# Altium schematic sheet FPGA RAM.SchDoc
size A
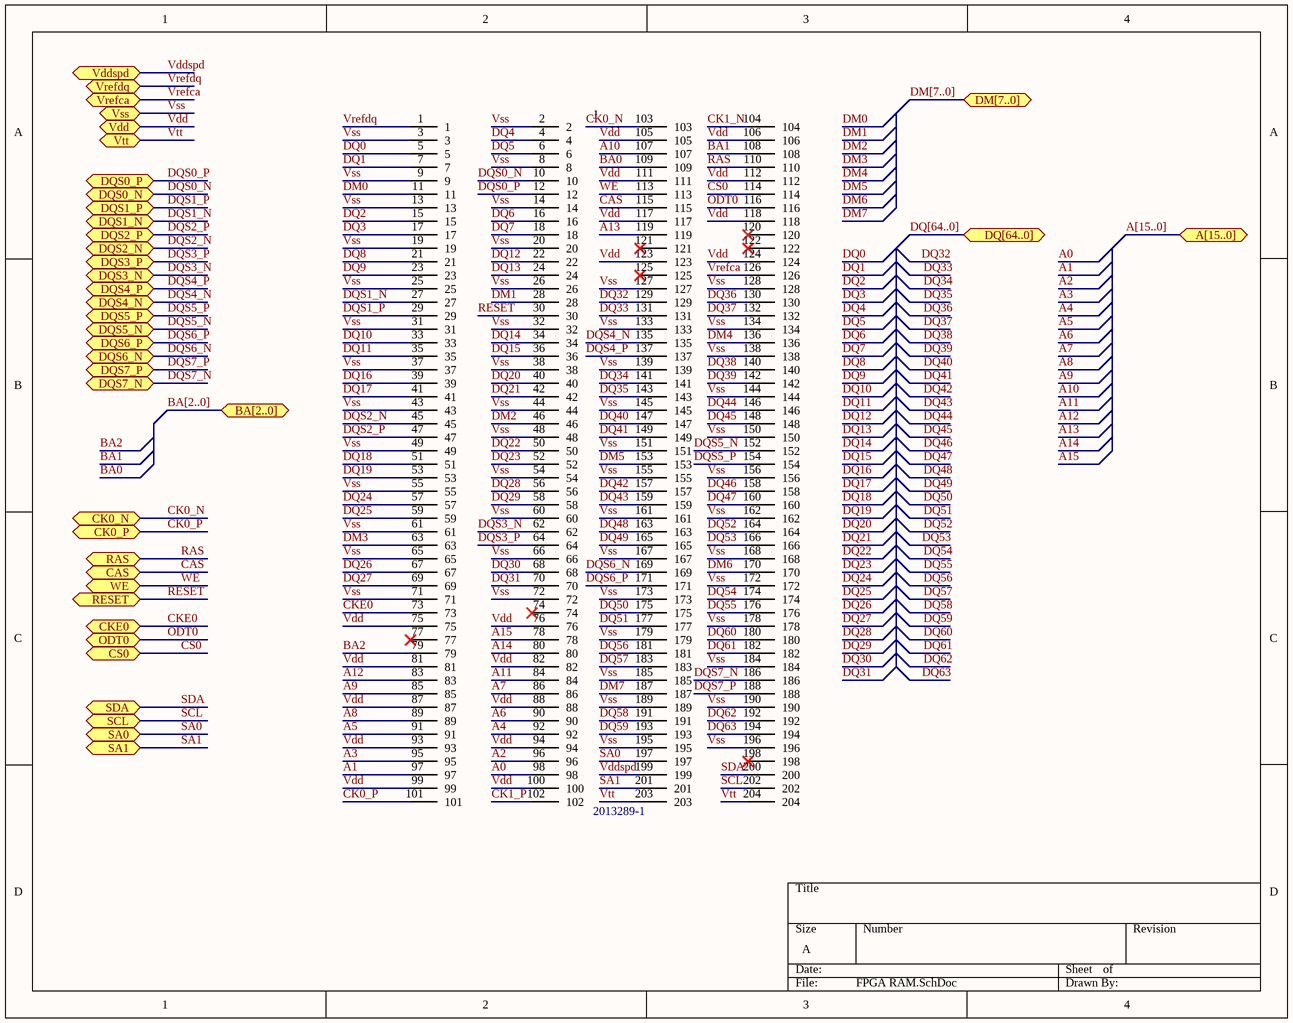
[diagram p0: FPGA RAM.SchDoc]

## Parts
J  2013289-1  [TE_2013289-1]

## Ports
A[15..0] (bidir), BA[2..0] (bidir), CAS (bidir), CK0_N (bidir), CK0_P (bidir), CKE0 (bidir), CS0 (bidir), DM[7..0] (bidir), DQ[64..0] (bidir), DQS0_N (bidir), DQS0_P (bidir), DQS1_N (bidir), DQS1_P (bidir), DQS2_N (bidir), DQS2_P (bidir), DQS3_N (bidir), DQS3_P (bidir), DQS4_N (bidir), DQS4_P (bidir), DQS5_N (bidir), DQS5_P (bidir), DQS6_N (bidir), DQS6_P (bidir), DQS7_N (bidir), DQS7_P (bidir), ODT0 (bidir), RAS (bidir), RESET (bidir), SA0 (bidir), SA1 (bidir), SCL (bidir), SDA (bidir), Vdd (bidir), Vddspd (bidir), Vrefca (bidir), Vrefdq (bidir), Vss (bidir), Vtt (bidir), WE (bidir)

## Nets
A0: J.98
A1: J.97
A2: J.96
A3: J.95
A4: J.92
A5: J.91
A6: J.90
A7: J.86
A8: J.89
A9: J.85
A10: J.107
A11: J.84
A12: J.83
A13: J.119
A14: J.80
A15: J.78
BA0: J.109
BA1: J.108
BA2: J.79
CAS: J.115 ; port CAS
CK0_N: J.103 ; port CK0_N
CK0_P: J.101 ; port CK0_P
CK1_N: J.104
CK1_P: J.102
CKE0: J.73 ; port CKE0
CS0: J.114 ; port CS0
DM0: J.11
DM1: J.28
DM2: J.46
DM3: J.63
DM4: J.136
DM5: J.153
DM6: J.170
DM7: J.187
DQ0: J.5
DQ1: J.7
DQ2: J.15
DQ3: J.17
DQ4: J.4
DQ5: J.6
DQ6: J.16
DQ7: J.18
DQ8: J.21
DQ9: J.23
DQ10: J.33
DQ11: J.35
DQ12: J.22
DQ13: J.24
DQ14: J.34
DQ15: J.36
DQ16: J.39
DQ17: J.41
DQ18: J.51
DQ19: J.53
DQ20: J.40
DQ21: J.42
DQ22: J.50
DQ23: J.52
DQ24: J.57
DQ25: J.59
DQ26: J.67
DQ27: J.69
DQ28: J.56
DQ29: J.58
DQ30: J.68
DQ31: J.70
DQ32: J.129
DQ33: J.131
DQ34: J.141
DQ35: J.143
DQ36: J.130
DQ37: J.132
DQ38: J.140
DQ39: J.142
DQ40: J.147
DQ41: J.149
DQ42: J.157
DQ43: J.159
DQ44: J.146
DQ45: J.148
DQ46: J.158
DQ47: J.160
DQ48: J.163
DQ49: J.165
DQ50: J.175
DQ51: J.177
DQ52: J.164
DQ53: J.166
DQ54: J.174
DQ55: J.176
DQ56: J.181
DQ57: J.183
DQ58: J.191
DQ59: J.193
DQ60: J.180
DQ61: J.182
DQ62: J.192
DQ63: J.194
DQS0_N: J.10 ; port DQS0_N
DQS0_P: J.12 ; port DQS0_P
DQS1_N: J.27 ; port DQS1_N
DQS1_P: J.29 ; port DQS1_P
DQS2_N: J.45 ; port DQS2_N
DQS2_P: J.47 ; port DQS2_P
DQS3_N: J.62 ; port DQS3_N
DQS3_P: J.64 ; port DQS3_P
DQS4_N: J.135 ; port DQS4_N
DQS4_P: J.137 ; port DQS4_P
DQS5_N: J.152 ; port DQS5_N
DQS5_P: J.154 ; port DQS5_P
DQS6_N: J.169 ; port DQS6_N
DQS6_P: J.171 ; port DQS6_P
DQS7_N: J.186 ; port DQS7_N
DQS7_P: J.188 ; port DQS7_P
ODT0: J.116 ; port ODT0
RAS: J.110 ; port RAS
RESET: J.30 ; port RESET
SA0: J.197 ; port SA0
SA1: J.201 ; port SA1
SCL: J.202 ; port SCL
SDA: J.200 ; port SDA
Vdd: J.75 J.76 J.81 J.82 J.87 J.88 J.93 J.94 J.99 J.100 J.105 J.106 J.111 J.112 J.117 J.118 J.123 J.124 ; port Vdd
Vddspd: J.199 ; port Vddspd
Vrefca: J.126 ; port Vrefca
Vrefdq: J.1 ; port Vrefdq
Vss: J.2 J.3 J.8 J.9 J.13 J.14 J.19 J.20 J.25 J.26 J.31 J.32 J.37 J.38 J.43 J.44 J.48 J.49 J.54 J.55 J.60 J.61 J.65 J.66 J.71 J.72 J.127 J.128 J.133 J.134 J.138 J.139 J.144 J.145 J.150 J.151 J.155 J.156 J.161 J.162 J.167 J.168 J.172 J.173 J.178 J.179 J.184 J.185 J.189 J.190 J.195 J.196 ; port Vss
Vtt: J.203 J.204 ; port Vtt
WE: J.113 ; port WE

Not connected (* = marked no-connect by the designer): J 74* 77* 120* 121* 122* 125* 198*

## Buses and harness runs
bus A[15..0] = port A[15..0]
bus BA[2..0] = port BA[2..0]
bus DM[7..0] = port DM[7..0]
bus DQ[64..0] = port DQ[64..0]

## Library data of the parts
J = 2013289-1: 204 Position 0.6 mm Pitch Right Angle Surface Mount Socket DIMM Connector; Number_of_Positions: 204; MF: TE Connectivity; Centerline_Pitch: .6 mm[.024 in]; Product_Type: Socket; Package: None; Digi-Key_Purchase_URL: https://www.digikey.com/product-detail/en/te-connectivity-amp-connectors/2013289-1/A115021-ND/2135546?utm_source=snapeda&utm_medium=aggregator&utm_campaign=symbol; Digi-Key_Part_Number: A115021-ND; SnapEDA_Link: https://www.snapeda.com/parts/2013289-1/TE%20Connectivity%20AMP%20Connectors/view-part/231016/?ref=snap; MP: 2013289-1; TE_purchase_URL: https://www.te.com/usa-en/product-2013289-1.html?te_bu=Cor&te_type=disp&te_campaign=seda_glo_cor-seda-global-disp-prtnr-fy19-seda-model-bom-cta_sma-317_1&elqCampaignId=32493; Value: *